# Altium schematic sheet filter pcb.SchDoc
size A; SheetNumber: 1; SheetTotal: 1; SPICEModelCacheEXBXCMIN: <root> / <DocumentId>EXBXCMIN</DocumentId> / <CacheFrame Number="0"> / <Model Name="cap" Kind="MDL"> / <Text>*Default semiconductor capacitor / .MODEL CAP C()</Text> / </Model> / </CacheFrame> / </root>
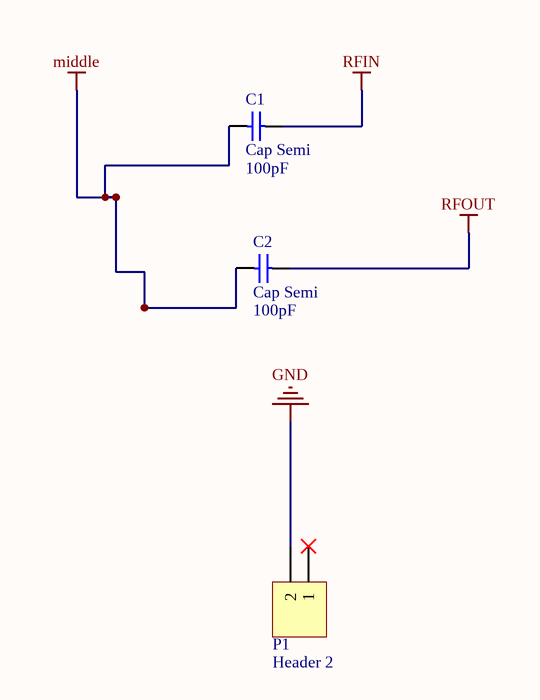
[diagram p0: filter pcb.SchDoc]

## Parts
C1  Cap Semi  value 100pF  [C1206]
C2  Cap Semi  value 100pF  [C1206]
P1  Header 2  [HDR1X2]

## Nets
GND: P1.2
middle: C1.1 C2.1
RFIN: C1.2
RFOUT: C2.2

Not connected (* = marked no-connect by the designer): P1 1*

## Library data of the parts
C1 C2 = Cap Semi: Capacitor (Semiconductor SIM Model); Published: 8-Jun-2000; LatestRevisionDate: 29-May-2009; LatestRevisionNote: IPC-7351 Footprint Added.; PackageReference: C1206; Publisher: Altium Limited; PackageDescription: Chip Capacitor
P1 = Header 2: Header, 2-Pin; LatestRevisionDate: 17-Jul-2002; LatestRevisionNote: Re-released for DXP Platform.; Publisher: Altium Limited